# EAGLE design midi_pad_laser_test (EAGLE 9.6.2)
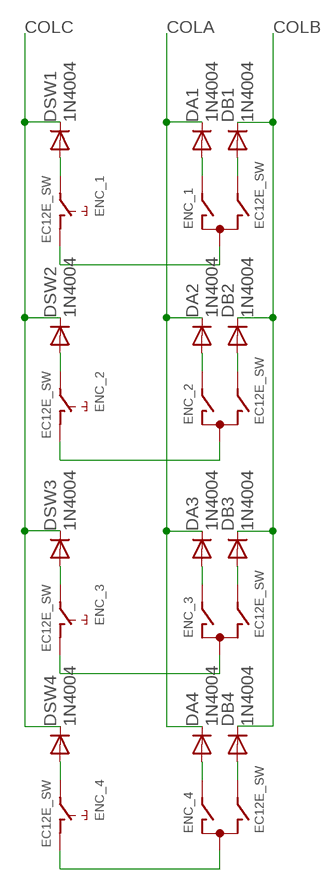
[diagram p0: schematic, sheet 1]

## Parts
DA1  1N4004  [DO41-10]
DA2  1N4004  [DO41-10]
DA3  1N4004  [DO41-10]
DA4  1N4004  [DO41-10]
DB1  1N4004  [DO41-10]
DB2  1N4004  [DO41-10]
DB3  1N4004  [DO41-10]
DB4  1N4004  [DO41-10]
DSW1  1N4004  [DO41-10]
DSW2  1N4004  [DO41-10]
DSW3  1N4004  [DO41-10]
DSW4  1N4004  [DO41-10]
ENC_1  EC12E_SW  [ALPS_EC12E_SW]
ENC_2  EC12E_SW  [ALPS_EC12E_SW]
ENC_3  EC12E_SW  [ALPS_EC12E_SW]
ENC_4  EC12E_SW  [ALPS_EC12E_SW]

## Nets
COLA: DA1.C DA2.C DA3.C DA4.C
COLB: DB1.C DB2.C DB3.C DB4.C
COLC: DSW1.C DSW2.C DSW3.C DSW4.C
N$20: DSW1.A ENC_1.E
N$21: DA1.A ENC_1.A
N$22: DB1.A ENC_1.B
N$23: DSW2.A ENC_2.E
N$24: DA2.A ENC_2.A
N$25: DB2.A ENC_2.B
N$26: DSW3.A ENC_3.E
N$27: DA3.A ENC_3.A
N$28: DB3.A ENC_3.B
N$29: DSW4.A ENC_4.E
N$30: DA4.A ENC_4.A
N$31: DB4.A ENC_4.B
ROW1: ENC_1.C ENC_1.D
ROW2: ENC_2.C ENC_2.D
ROW3: ENC_3.C ENC_3.D
ROW4: ENC_4.C ENC_4.D
Unconnected: ENC_1.GND1(G) ENC_1.GND2(G) ENC_2.GND1(G) ENC_2.GND2(G) ENC_3.GND1(G) ENC_3.GND2(G) ENC_4.GND1(G) ENC_4.GND2(G)

## Library data of the parts
DA1-DA4 DB1-DB4 DSW1-DSW4 = adafruit:1N4004: DIODE General purpose 1N400x type rectifier (With bigger pads) http://www.ladyada.net/library/pcb/eaglelibrary.html
ENC_1-ENC_4 = switch-alps:EC12E_SW: ALPS rotary Encoder EC12E series with switch; MPN: EC12E2424407; OC_FARNELL: 1520813; OC_NEWARK: 74M1068

## Board
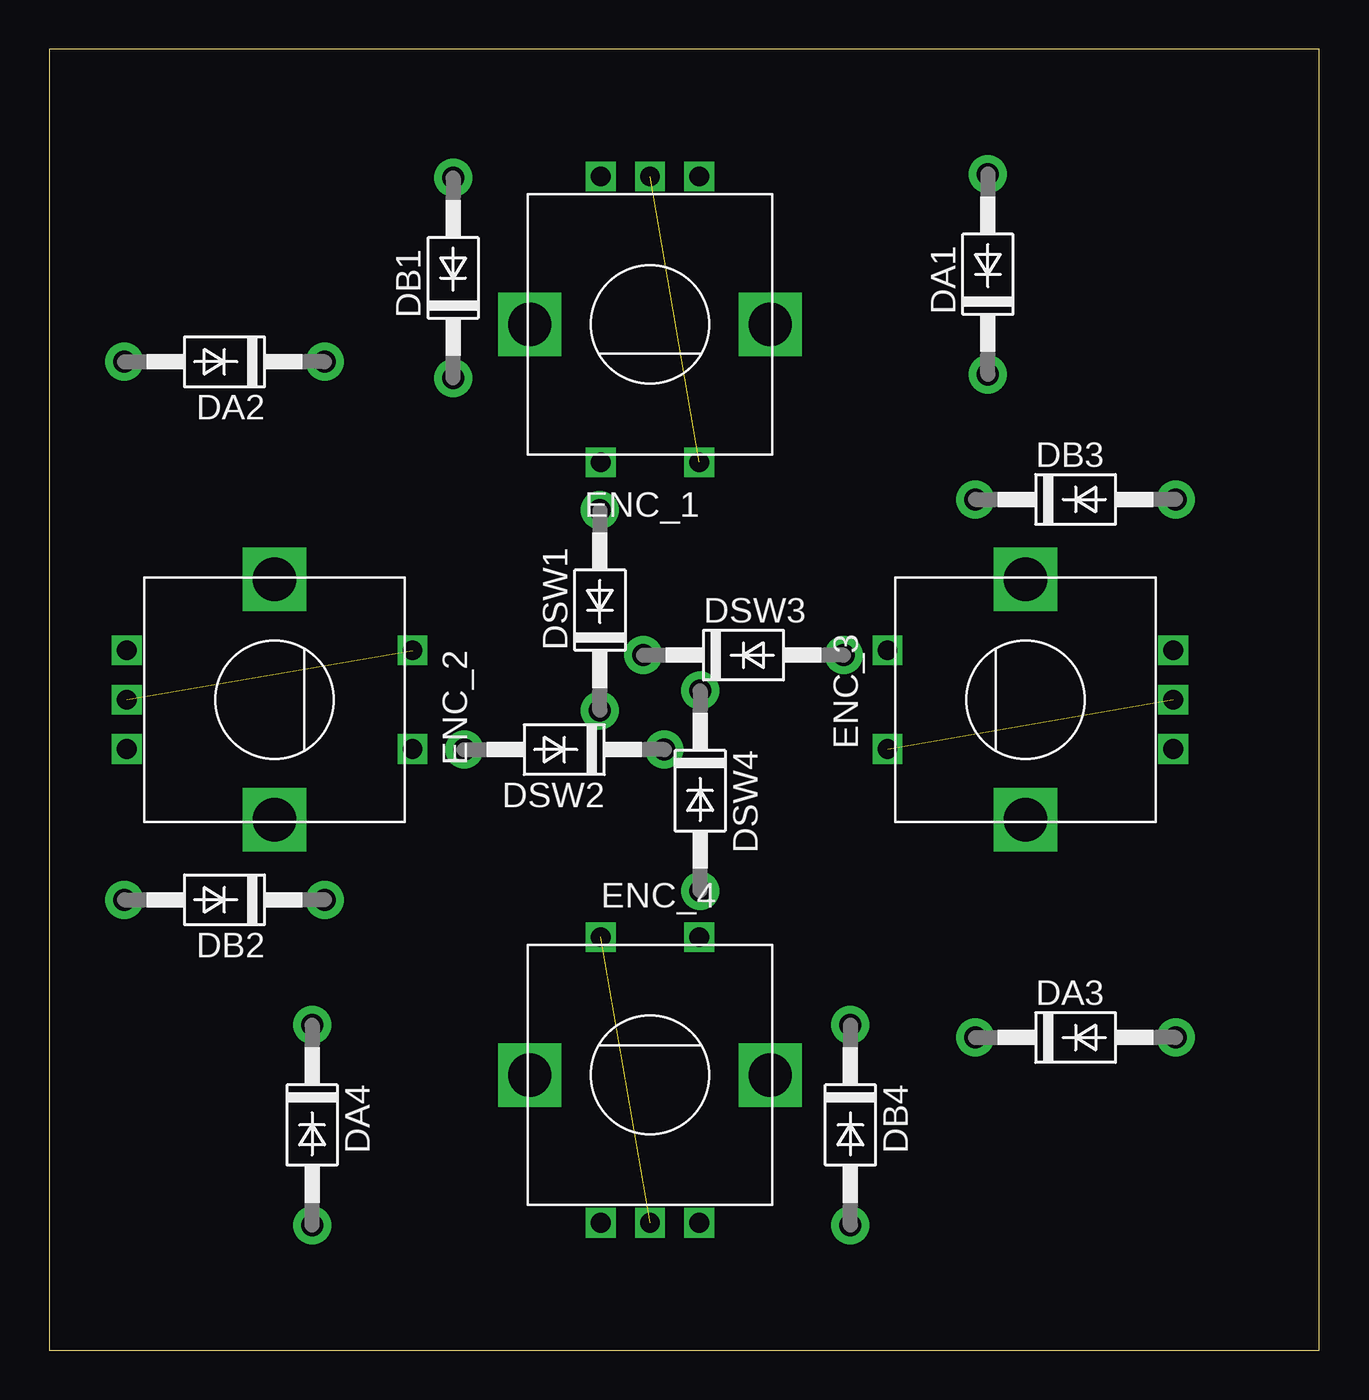
[diagram p1: board, top side]
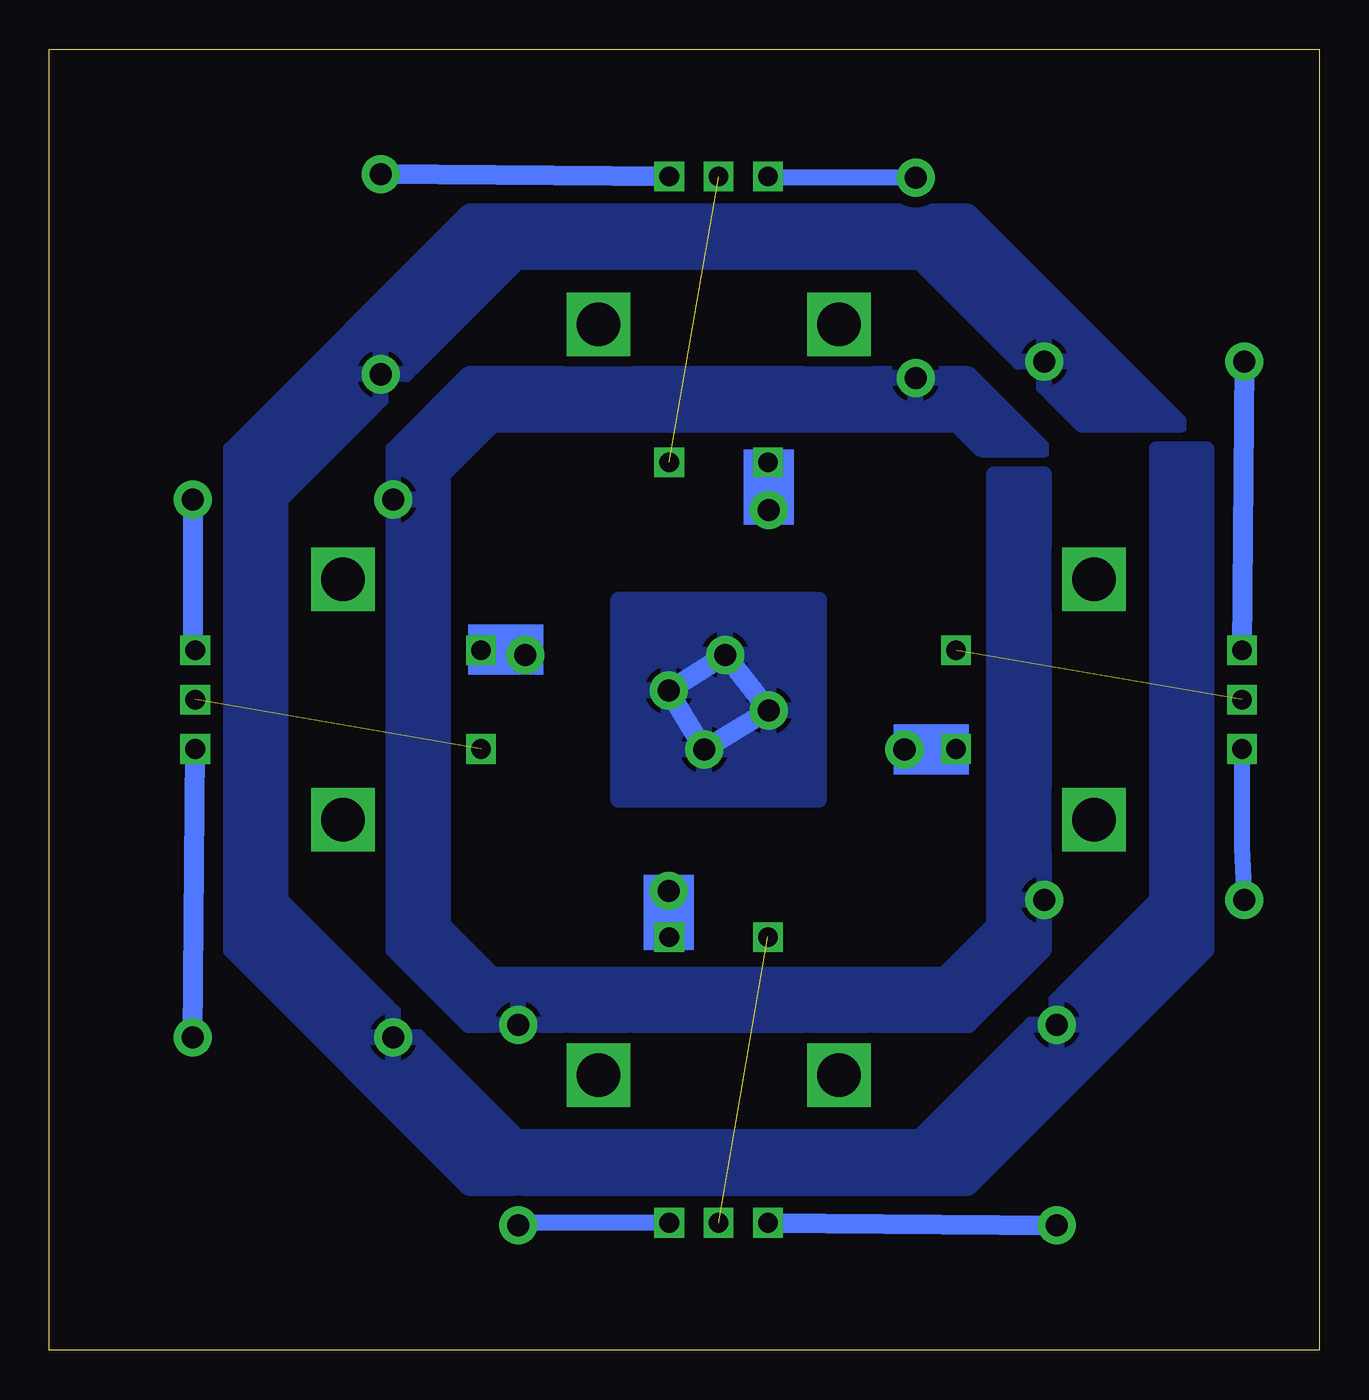
[diagram p2: board, bottom side, seen from below]

Size 64.44 x 66.03 mm. Coordinates in mm from the lower left corner, seen from the top.
Outline: 0,0 64.44,0 64.44,66.03 0,66.03 0,0
Copper layers (1+2*15+16): Top 0.035mm / dielectric 1.5mm / Route2 0.035mm / dielectric 0.15mm / Route15 0.035mm / dielectric 0.2mm / Bottom 0.035mm
Design rules "default *": minimum track width 6mil, minimum drill 0.35mm, track to track 6mil, track to pad 6mil, pad to pad 6mil, via to via 6mil, smd to smd 6mil, copper to edge 40mil, drill to drill 6mil, minimum pad ring 10mil, minimum via ring 8mil, stop-mask expansion 4mil, vias tented up to drill 0mil, thermal gap 10mil

### Footprints (pad centres in the part's own frame; a part is rotated, then mirrored left to right if it is on the bottom)
DO41-10 = drill 1.118 pad 1.93: A 5.08,0; C -5.08,0
ALPS_EC12E_SW = drill 1 square: A -2.5,-7.5; B 2.5,-7.5; C 0,-7.5; D -2.5,7; E 2.5,7 | drill 2.2 square: GND1 -6.1,0; GND2 6.1,0

### Placement (x,y rotation side)
DA1  47.62,54.61 90 top
DA2  8.89,50.16 180 top
DA3  52.07,15.88 0 top
DA4  13.34,11.43 270 top
DB1  20.49,54.42 90 top
DB2  8.89,22.86 180 top
DB3  52.07,43.18 0 top
DB4  40.64,11.43 270 top
DSW1  27.94,37.56 90 top
DSW2  26.13,30.48 180 top
DSW3  35.22,35.28 0 top
DSW4  33.02,28.4 270 top
ENC_1  30.48,52.07 180 top
ENC_2  11.43,33.02 270 top
ENC_3  49.53,33.02 90 top
ENC_4  30.48,13.97 0 top

### Tracks (layer width: path | path; a pad name or v marks a point on that pad's centre or on a via)
COLA
  pour Bottom (isolate 0.533, rank 6): 5.71,45.72 8.26,45.72 8.26,22.86 20.32,10.79 40.64,10.79 52.7,22.86 52.7,43.18 40.64,55.24 20.32,55.24 12.06,46.99 6.99,46.99 17.78,57.78 43.18,57.78 55.24,45.72 55.24,20.32 43.18,8.26 17.78,8.26 5.71,20.32
COLB
  pour Bottom (isolate 0.533, rank 6): 13.97,44.45 16.51,44.45 16.51,21.59 19.05,19.05 41.91,19.05 44.45,21.59 44.45,44.45 41.91,46.99 18.41,46.99 17.14,45.72 13.97,45.72 17.78,49.53 43.18,49.53 46.99,45.72 46.99,20.32 43.18,16.51 17.78,16.51 13.97,20.32
COLC
  Bottom 1.016: DSW1.C DSW2.C DSW4.C DSW3.C DSW1.C
  pour Bottom (isolate 0.533, rank 6): 25.4,38.1 25.4,27.94 35.56,27.94 35.56,38.1
N$20
  Bottom 1.016: ENC_1.E DSW1.A
N$21
  Bottom 1.016: ENC_1.A DA1.A
N$22
  Bottom 0.813: DB1.A 27.93,59.52 ENC_1.B
N$23
  Bottom 1.016: ENC_2.E DSW2.A
N$24
  Bottom 1.016: DA2.A ENC_2.A
N$25
  Bottom 0.813: ENC_2.B 3.93,25.52 DB2.A
N$26
  Bottom 1.016: DSW3.A ENC_3.E
N$27
  Bottom 1.016: DA3.A ENC_3.A
N$28
  Bottom 0.813: 57.15,35.64 ENC_3.B
  Bottom 1.016: DB3.A 57.15,35.64
N$29
  Bottom 1.016: DSW4.A ENC_4.E
N$30
  Bottom 1.016: DA4.A ENC_4.A
N$31
  Bottom 0.813: ENC_4.B 40.02,6.47 DB4.A
ROW1  (1 unrouted)
ROW2  (1 unrouted)
ROW3  (1 unrouted)
ROW4  (1 unrouted)
(copper drawn outside any net)
  shapes: Bottom area x4